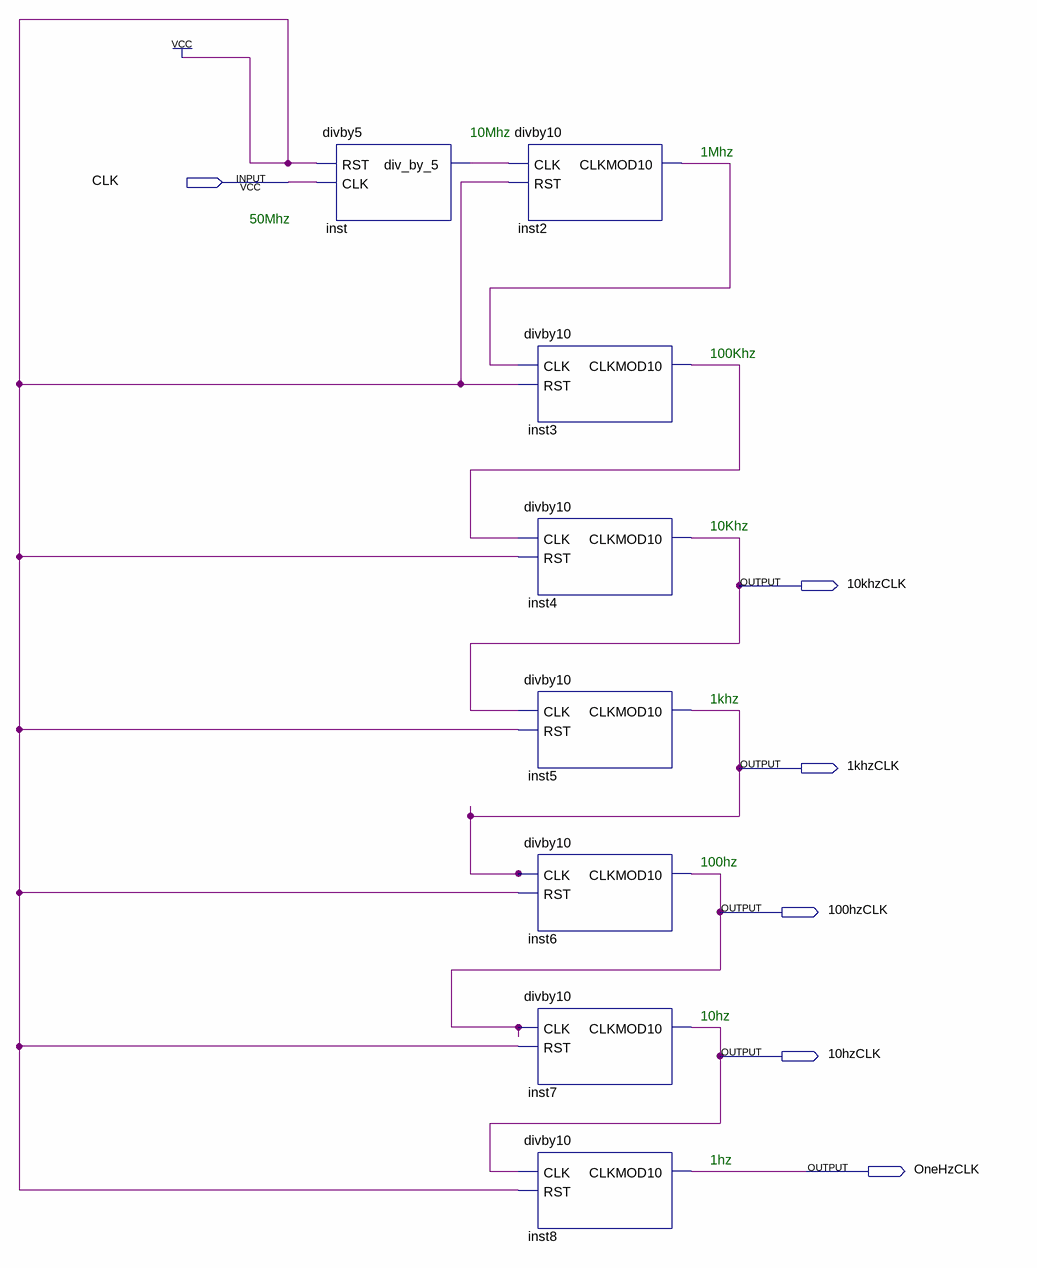
[diagram p0: schematic sheet]
// Quartus schematic 1hz_clock.bdf as structural Verilog: 8 symbols, 6 pins
module \1hz_clock  (
  input  CLK,
  output \10khzCLK ,
  output \1khzCLK ,
  output \100hzCLK ,
  output \10hzCLK ,
  output OneHzCLK
);

  wire inst2_clkmod10, inst3_clkmod10, inst_div_by_5;

  divby5 inst (.RST(1'b1), .CLK(CLK), .div_by_5(inst_div_by_5));
  divby10 inst2 (.CLK(inst_div_by_5), .RST(1'b1), .CLKMOD10(inst2_clkmod10));
  divby10 inst3 (.CLK(inst2_clkmod10), .RST(1'b1), .CLKMOD10(inst3_clkmod10));
  divby10 inst4 (.CLK(inst3_clkmod10), .RST(1'b1), .CLKMOD10(\10khzCLK ));
  divby10 inst5 (.CLK(\10khzCLK ), .RST(1'b1), .CLKMOD10(\1khzCLK ));
  divby10 inst6 (.CLK(\1khzCLK ), .RST(1'b1), .CLKMOD10(\100hzCLK ));
  divby10 inst7 (.CLK(\100hzCLK ), .RST(1'b1), .CLKMOD10(\10hzCLK ));
  divby10 inst8 (.CLK(\10hzCLK ), .RST(1'b1), .CLKMOD10(OneHzCLK));

  // Notes on the sheet:
  //   10Mhz
  //   1Mhz
  //   50Mhz
  //   100Khz
  //   10Khz
  //   1khz
  //   100hz
  //   10hz
  //   1hz
endmodule
